# EAGLE schematic transmitter_bc548_crystal (EAGLE 9.6.2)
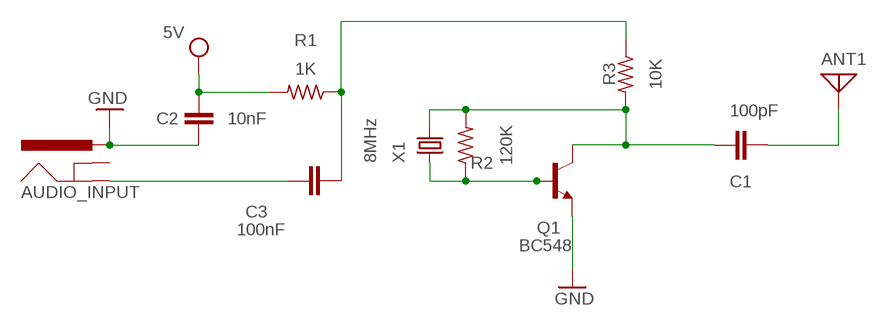
[diagram p0: schematic, sheet 1]

## Parts
ANT1  ANTENNA  [PAD-01]
AUDIO_INPUT  POWER_JACKPTH_SMD_COMBO  [POWER_JACK_COMBO]
C1  100pF  CXXC10B6  [XC10B6]
C2  10nF  CXXC10B6  [XC10B6]
C3  100nF  CXXC10B6  [XC10B6]
Q1  BC548  [TO92-EBC]
R1  1K  R-US_AXIAL-7.2MM-PITCH  [RESAD724W46L381D178B]
R2  120K  R-US_AXIAL-7.2MM-PITCH  [RESAD724W46L381D178B]
R3  10K  R-US_AXIAL-7.2MM-PITCH  [RESAD724W46L381D178B]
X1  8MHz  CRYSTAL68SMX  [86SMX]

## Nets
GND: AUDIO_INPUT.POWER(PWR) C2.2 Q1.E
N$1: C3.2 R1.1 R3.1
N$2: AUDIO_INPUT.GND@1(GND) C3.1
N$3: Q1.B R2.1 X1.1
N$5: C1.1 Q1.C R2.2 R3.2 X1.4
N$6: ANT1.1 C1.2
VCC: C2.1 R1.2
Unconnected: AUDIO_INPUT.GND(GNDBREAK)

## Library data of the parts
ANT1 = discrete:ANTENNA: Antenna
AUDIO_INPUT = SparkFun-Connectors:POWER_JACK: Power Jack Connector This is the standard 5.5mm barrel jack for power. The PTH is the most common, proven, reliable, footprint. The Slot footprint only works if the mill layer is transmitted to the PCB fab house so be warned. Here are the connectors we sell at SparkFun: DC Barrel Power Jack/Connector <https://www.sparkfun.com/products/119> (PRT-00119) DC Barrel Power Jack/Connector (SMD) <https://www.sparkfun.com/products/12748> (PRT-12748) DC Barrel Jack Adapter - Breadboard Compatible <https://www.sparkfun.com/products/10811> (PRT-10811) It is used on this SparkFun product (and many, many others): SparkFun RedBoard - Programmed with Arduino <https://www.sparkfun.com/products/12757> (DEV-12757) Also, if you need a mating power supply or connector, please check these out: Wall Adapter Power Supply - 9VDC 650mA <https://www.sparkfun.com/products/298> (TOL-00298) DC Barrel Jack Adapter - Male <https://www.sparkfun.com/products/10287> (PRT-10287)
C1-C3 = rcl:CX: X CAPACITOR for power line; SPICEPREFIX: C
Q1 = transistor-npn:BC548*: NPN Transistor
R1-R3 = Resistor:R-US: Resistor Fixed - ANSI; CATEGORY: Resistor; SUB-CATEGORY: Fixed
X1 = adafruit:CRYSTAL: CRYSTAL; OC_FARNELL: 6344860; OC_NEWARK: unknown